# EAGLE design MN_RFID (EAGLE 9.3.1)
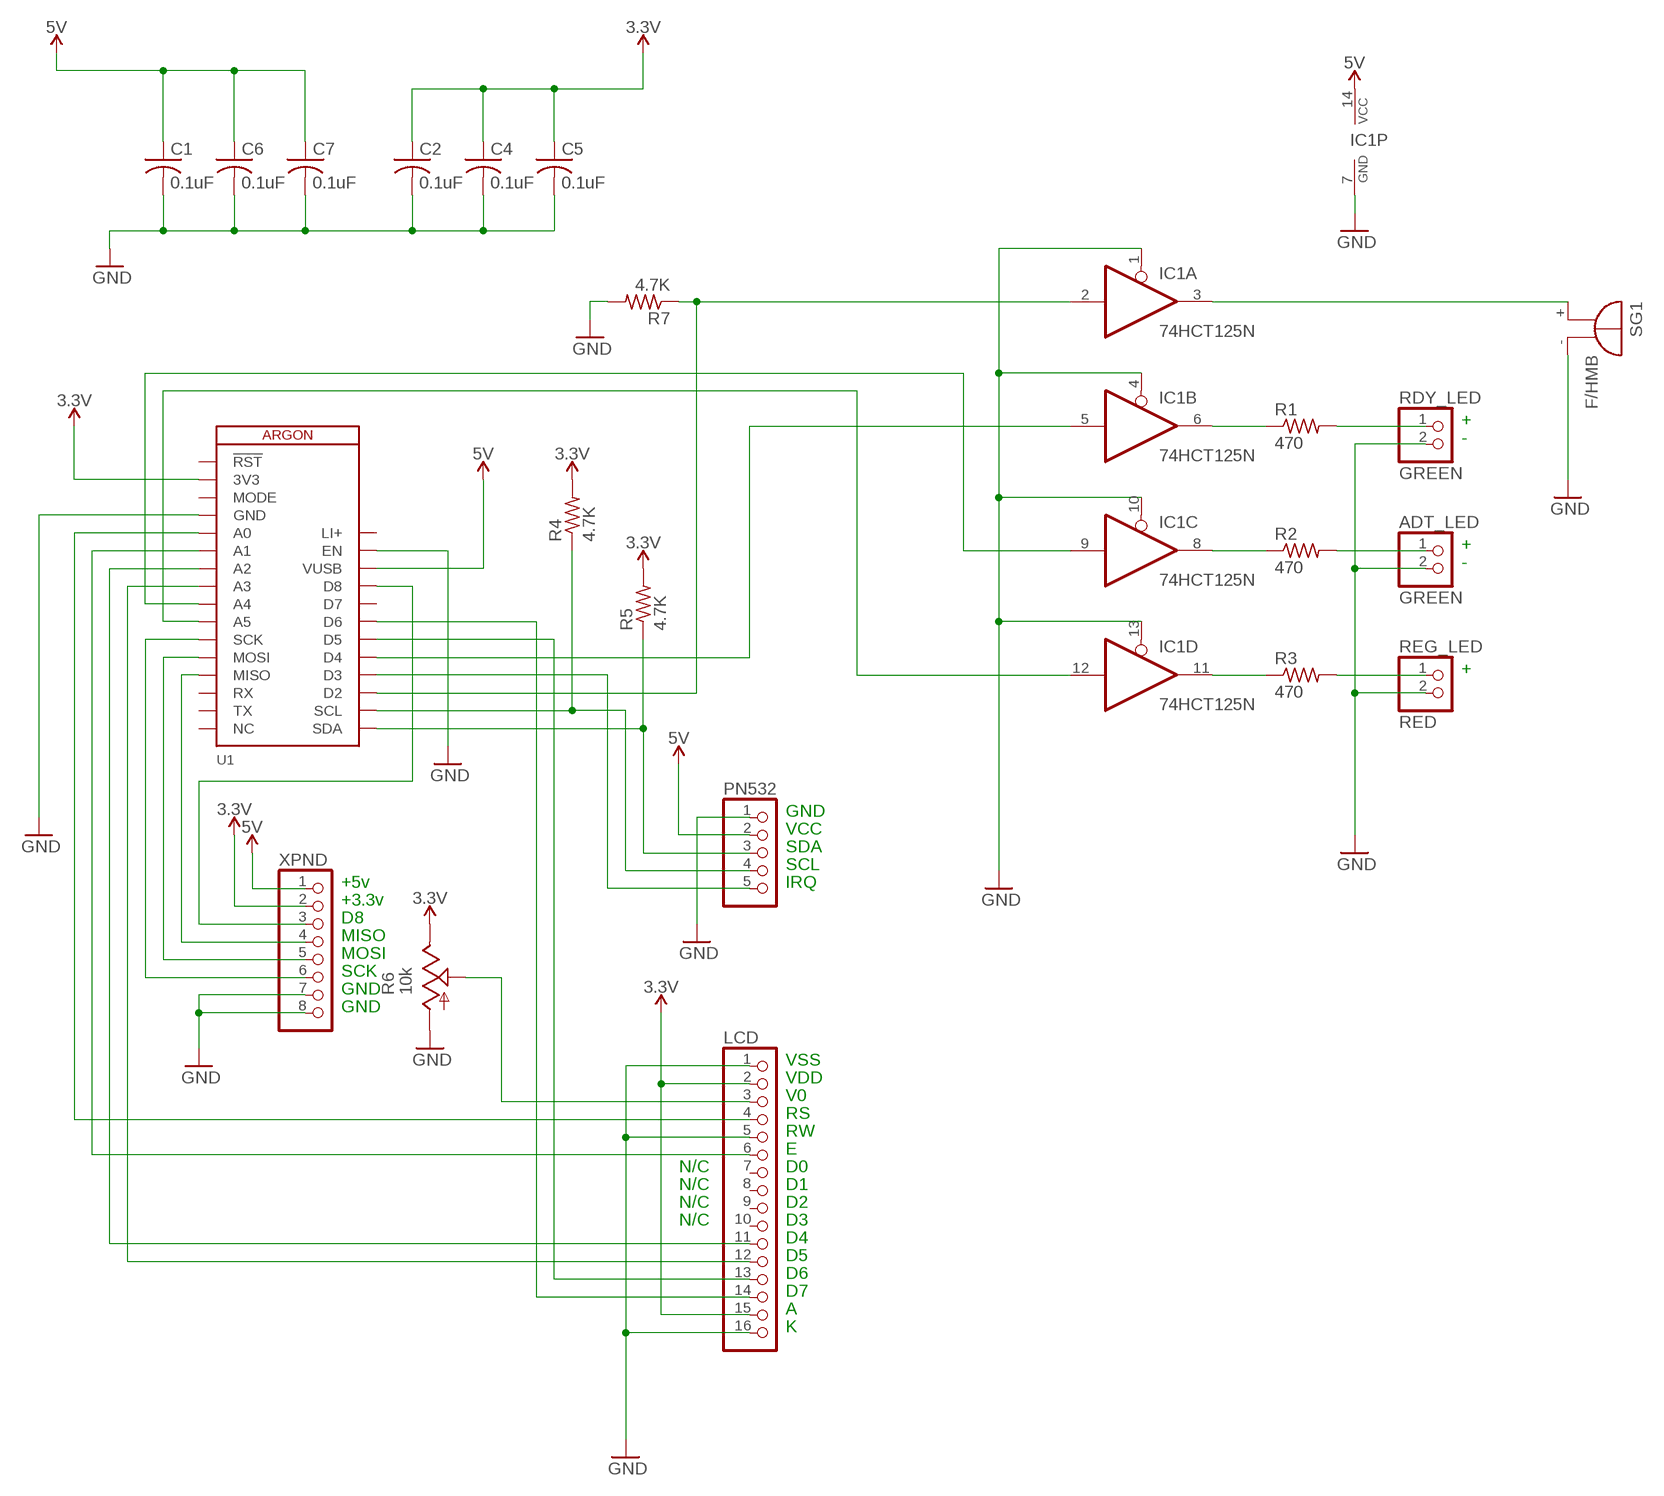
[diagram p0: schematic, sheet 1]

## Parts
ADT_LED  GREEN  PINHD-1X2  [1X02]
C1  0.1uF  C-US025-024X044  [C025-024X044]
C2  0.1uF  C-US025-024X044  [C025-024X044]
C4  0.1uF  C-US025-024X044  [C025-024X044]
C5  0.1uF  C-US025-024X044  [C025-024X044]
C6  0.1uF  C-US025-024X044  [C025-024X044]
C7  0.1uF  C-US025-024X044  [C025-024X044]
IC1  74HCT125N  [DIL14]
LCD  PINHD-1X16  [1X16]
PN532  PINHD-1X5  [1X05]
R1  470  R-US_0204/7  [0204/7]
R2  470  R-US_0204/7  [0204/7]
R3  470  R-US_0204/7  [0204/7]
R4  4.7K  R-US_0204/7  [0204/7]
R5  4.7K  R-US_0204/7  [0204/7]
R6  10k  TRIM_US-CT6  [CT6]
R7  4.7K  R-US_0204/7  [0204/7]
RDY_LED  GREEN  PINHD-1X2  [1X02]
REG_LED  RED  PINHD-1X2  [1X02]
SG1  F/HMB  [F/HMB]
U1  ARGON  [ARGON]
XPND  PINHD-1X8BIG  [1X08-BIG]

## Nets
3.3V: C2.1 C4.1 C5.1 LCD.2 LCD.15 R4.2 R5.2 R6.E U1.2(3V3) XPND.2
5V: C1.1 C6.1 C7.1 IC1.14(P:VCC) PN532.2 U1.26(VUSB) XPND.1
GND: ADT_LED.2 C1.2 C2.2 C4.2 C5.2 C6.2 C7.2 IC1.1(A:OE) IC1.4(B:OE) IC1.7(P:GND) IC1.10(C:OE) IC1.13(D:OE) LCD.1 LCD.5 LCD.16 PN532.1 R6.A R7.2 RDY_LED.2 REG_LED.2 SG1.- U1.4(GND) U1.27(EN) XPND.7 XPND.8
N$1: IC1.3(A:O) SG1.+
N$2: IC1.6(B:O) R1.1
N$3: IC1.8(C:O) R2.1
N$4: IC1.11(D:O) R3.1
N$5: R1.2 RDY_LED.1
N$6: ADT_LED.1 R2.2
N$7: R3.2 REG_LED.1
N$8: LCD.4 U1.5(A0)
N$9: LCD.6 U1.6(A1)
N$10: LCD.11 U1.7(A2)
N$11: LCD.12 U1.8(A3)
N$12: LCD.13 U1.22(D5)
N$13: LCD.14 U1.23(D6)
N$14: PN532.4 R4.1 U1.18(SCL)
N$15: IC1.9(C:I) U1.9(A4)
N$16: PN532.3 R5.1 U1.17(SDA)
N$17: LCD.3 R6.S
N$18: PN532.5 U1.20(D3)
N$19: U1.25(D8) XPND.3
N$20: IC1.5(B:I) U1.21(D4)
N$21: IC1.12(D:I) U1.10(A5)
N$22: IC1.2(A:I) R7.1 U1.19(D2)
N$23: U1.13(MISO) XPND.4
N$24: U1.12(MOSI) XPND.5
N$25: U1.11(SCK) XPND.6
Unconnected: LCD.7 LCD.8 LCD.9 LCD.10 U1.1(!RST) U1.3(MODE) U1.14(RX) U1.15(TX) U1.16(NC) U1.24(D7)

## Notes on the sheet
- +
- -
- +
- -
- +
- GND
- VCC
- SDA
- SCL
- +5v | IRQ
- +3.3v
- D8
- MISO
- MOSI
- SCK
- GND
- GND
- VSS
- VDD
- V0
- RS
- RW
- E
- N/C | D0
- N/C | D1
- N/C | D2
- N/C | D3
- D4
- D5
- D6
- D7
- A
- K

## Power pins joined to a net without a drawn wire
LI+: U1.28(LI+)

## Library data of the parts
ADT_LED RDY_LED REG_LED = pinhead:PINHD-1X2: PIN HEADER
C1 C2 C4-C7 = adafruit:C-US: CAPACITOR, American symbol
IC1 = 74xx-eu:74*125: Quad bus BUFFER, 3-state
LCD = pinhead:PINHD-1X16: PIN HEADER
PN532 = pinhead:PINHD-1X5: PIN HEADER
R1-R5 R7 = adafruit:R-US_: RESISTOR, American symbol
R6 = pot:TRIM_US-: POTENTIOMETER
SG1 = buzzer:F/HMB: BUZZER Source: Buerklin; OC_FARNELL: unknown; OC_NEWARK: unknown
U1 = Particle-Devices:ARGON: ARGON The Particle Argon is a powerful Wi-Fi development kit that you can use as a standalone Wi-Fi device or Wi-Fi enabled gateway, repeater, or endpoint for Particle Mesh networks. More information: https://docs.particle.io/argon/ Footprint and formfactor based on Adafruit Feather. <https://www.adafruit.com/feather>
XPND = adafruit:PINHD-1X8: PIN HEADER

## Board
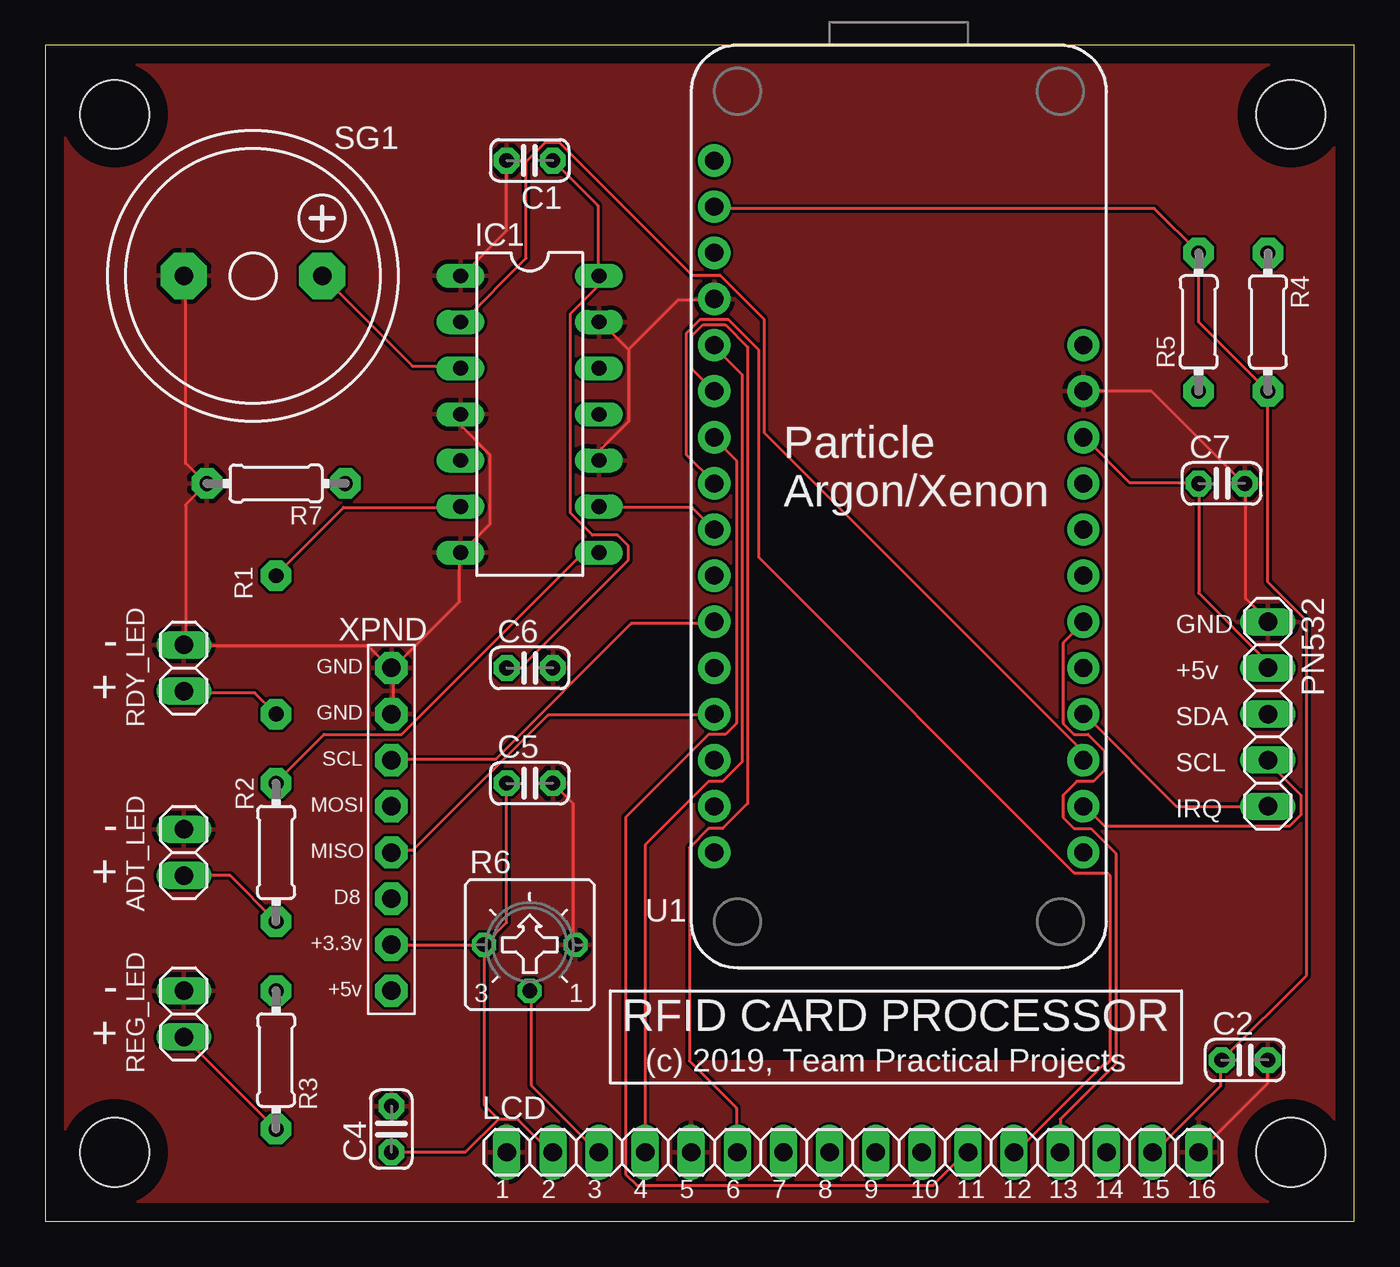
[diagram p1: board, top side]
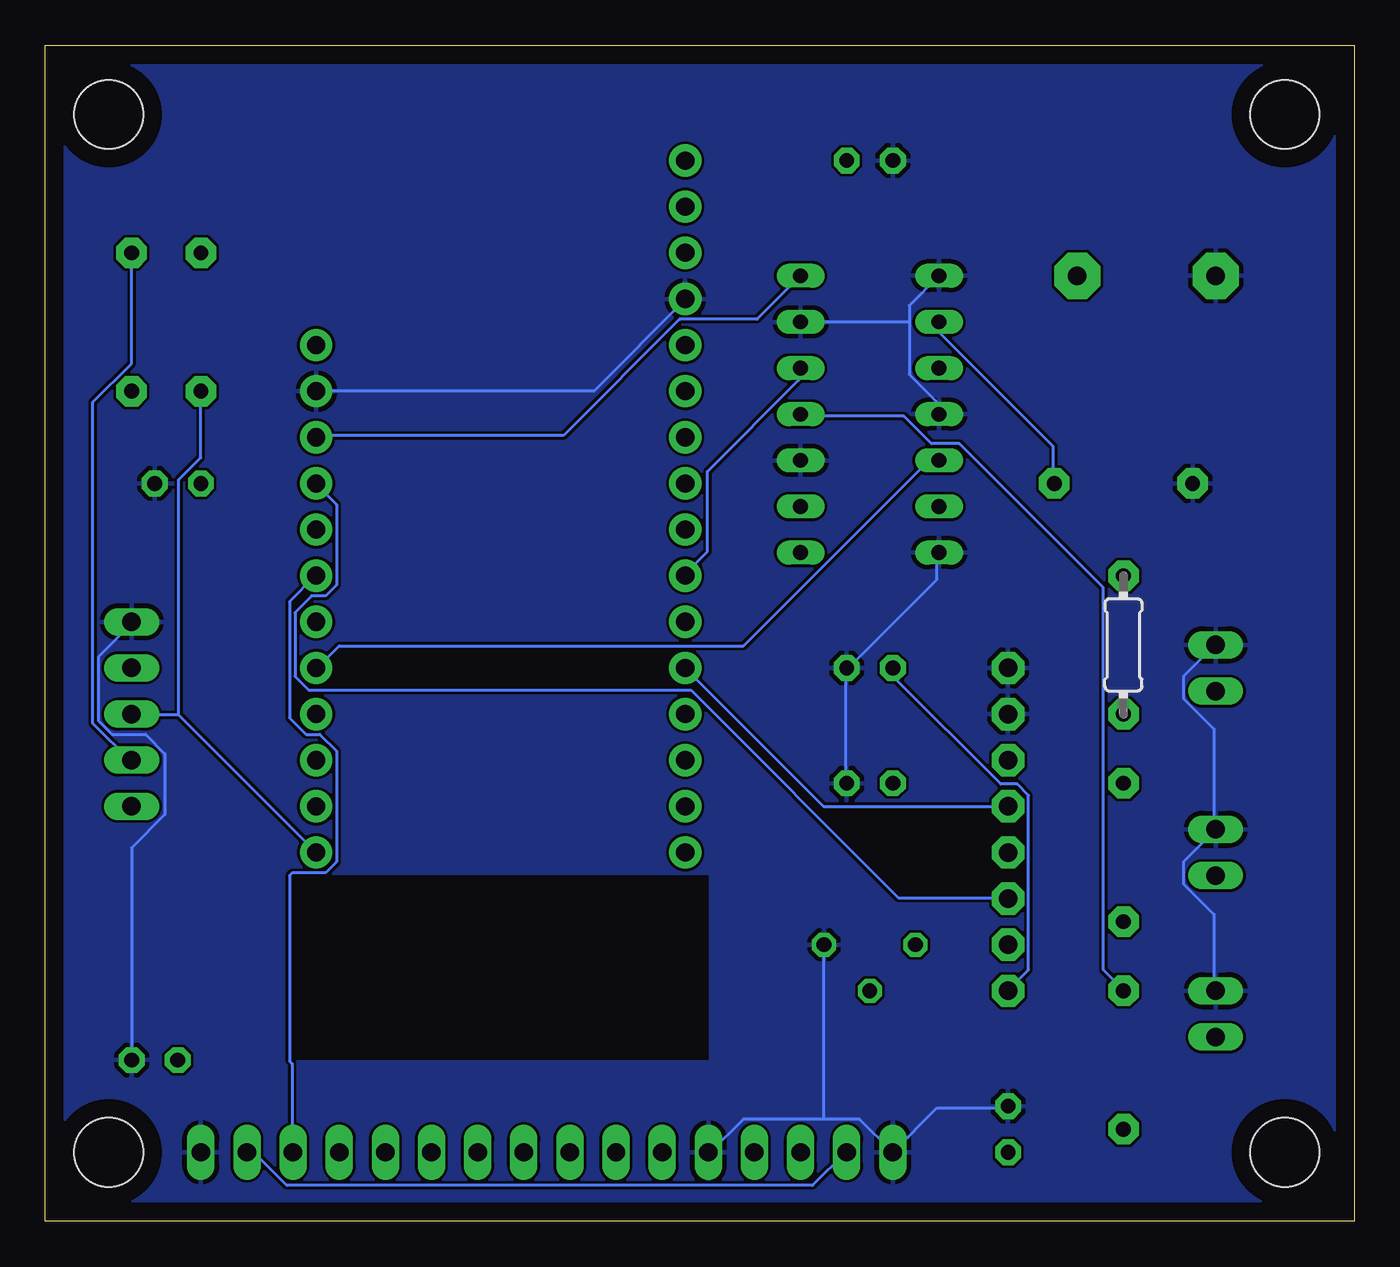
[diagram p2: board, bottom side, seen from below]

Size 72.06 x 64.76 mm. Coordinates in mm from the lower left corner, seen from the top.
Outline: 0,0 72.06,0 72.06,64.76 0,64.76 0,0
Copper layers (1*16): Top 0.035mm / dielectric 1.5mm / Bottom 0.035mm
Design rules "default": minimum track width 6mil, minimum drill 0.35mm, track to track 6mil, track to pad 6mil, pad to pad 6mil, via to via 6mil, smd to smd 6mil, copper to edge 40mil, drill to drill 6mil, minimum pad ring 10mil, minimum via ring 8mil, stop-mask expansion 4mil, vias tented up to drill 0mil, thermal gap 10mil
Holes 3.8 mm at 3.81,60.96 68.58,60.96 3.81,3.81 68.58,3.81

### Footprints (pad centres in the part's own frame; a part is rotated, then mirrored left to right if it is on the bottom)
1X02 = drill 1.016 long: 1 -1.27,0; 2 1.27,0
C025-024X044 = drill 0.813 pad 1.422 octagon: 1 -1.27,0; 2 1.27,0
DIL14 = drill 0.813 long: 1 -7.62,-3.81; 2 -5.08,-3.81; 3 -2.54,-3.81; 4 0,-3.81; 5 2.54,-3.81; 6 5.08,-3.81; 7 7.62,-3.81; 8 7.62,3.81; 9 5.08,3.81; 10 2.54,3.81; 11 0,3.81; 12 -2.54,3.81; 13 -5.08,3.81; 14 -7.62,3.81
1X16 = drill 1.016 long: 1 -19.05,0; 2 -16.51,0; 3 -13.97,0; 4 -11.43,0; 5 -8.89,0; 6 -6.35,0; 7 -3.81,0; 8 -1.27,0; 9 1.27,0; 10 3.81,0; 11 6.35,0; 12 8.89,0; 13 11.43,0; 14 13.97,0; 15 16.51,0; 16 19.05,0
1X05 = drill 1.016 long: 1 -5.08,0; 2 -2.54,0; 3 0,0; 4 2.54,0; 5 5.08,0
0204/7 = drill 0.813 pad 1.676 octagon: 1 -3.81,0; 2 3.81,0
CT6 = drill 0.813 octagon: A 2.515,0; E -2.515,0; S 0,-2.54
F/HMB = drill 1.016 pad 2.54 octagon: + 3.81,0; - -3.81,0
ARGON = drill 1 pad 1.778: 1 1.27,44.45; 2 1.27,41.91; 3 1.27,39.37; 4 1.27,36.83; 5 1.27,34.29; 6 1.27,31.75; 7 1.27,29.21; 8 1.27,26.67; 9 1.27,24.13; 10 1.27,21.59; 11 1.27,19.05; 12 1.27,16.51; 13 1.27,13.97; 14 1.27,11.43; 15 1.27,8.89; 16 1.27,6.35; 17 21.59,6.35; 18 21.59,8.89; 19 21.59,11.43; 20 21.59,13.97; 21 21.59,16.51; 22 21.59,19.05; 23 21.59,21.59; 24 21.59,24.13; 25 21.59,26.67; 26 21.59,29.21; 27 21.59,31.75; 28 21.59,34.29
1X08-BIG = drill 1.016 pad 1.778 octagon: 1 -8.89,0; 2 -6.35,0; 3 -3.81,0; 4 -1.27,0; 5 1.27,0; 6 3.81,0; 7 6.35,0; 8 8.89,0

### Placement (x,y rotation side)
ADT_LED  7.62,20.32 90 top
C1  26.67,58.42 180 top
C2  66.04,8.89 0 top
C4  19.05,5.08 90 top
C5  26.67,24.13 0 top
C6  26.67,30.48 0 top
C7  64.77,40.64 0 top
IC1  26.67,44.45 270 top
LCD  44.45,3.81 0 top
PN532  67.31,27.94 270 top
R1  12.7,31.75 270 bottom
R2  12.7,20.32 270 top
R3  12.7,8.89 270 top
R4  67.31,49.53 270 top
R5  63.5,49.53 90 top
R6  26.67,15.24 0 top
R7  12.7,40.64 180 top
RDY_LED  7.62,30.48 90 top
REG_LED  7.62,11.43 90 top
SG1  11.43,52.07 0 top
U1  35.56,13.97 0 top
XPND  19.05,21.59 90 top

### Tracks (layer width: path | path; a pad name or v marks a point on that pad's centre or on a via)
3.3V
  Top 0.152: U1.2 36.83,55.78 61.06,55.78 R5.2 63.5,49.53 R4.2 67.31,35.2 69.44,33.07 69.44,13.56 C2.1 64.72,8.84 64.72,7.47 61.06,3.81 LCD.15 | XPND.2 R6.E 24.18,15.24 | C5.1 25.4,16.46 24.18,15.24 | C4.1 23.11,3.81 24.94,5.64 | 24.94,5.64 26.01,5.64 27.84,3.81 LCD.2 | 24.18,15.24 24.18,6.4 24.94,5.64
  Bottom 0.152: LCD.15 60.6,3.81 58.78,1.98 29.82,1.98 27.99,3.81 LCD.2
5V
  Top 0.152: U1.26 57.25,43.13 59.69,40.69 63.5,40.69 C7.1 63.5,34.59 67.31,30.78 PN532.2 | C1.1 30.43,55.93 30.43,52.12 IC1.14 30.43,51.97 30.43,51.51 28.91,49.99 28.91,39.01 30.12,37.79 31.5,37.79 32.11,37.19 32.11,36.42 26.16,30.48 C6.1
  Bottom 0.152: C6.1 25.4,30.02 19.46,24.08 18.54,24.08 17.93,23.47 17.93,13.87 19,12.8 XPND.1 | IC1.14 32.87,49.68 37.13,49.68 43.54,43.28 57.1,43.28 U1.26
GND
  Top 0.152: C2.2 67.31,7.62 LCD.16 | PN532.1 67.31,33.07 66.09,34.29 66.09,40.54 C7.2 65.94,40.69 60.91,45.72 U1.27 | SG1.- 7.72,51.97 7.72,41.76 8.79,40.69 R7.2 7.72,39.47 7.72,31.85 RDY_LED.2 7.72,31.7 17.78,31.7 19,30.48 XPND.8 19.15,30.48 | 32.11,48.01 32.11,44.04 30.58,42.52 30.58,41.91 IC1.10 | 32.11,48.01 30.58,49.53 IC1.13 | 32.11,48.01 34.85,50.75 36.83,50.75 U1.4 | C1.2 25.4,54.56 22.96,52.12 IC1.1 | 19.15,30.48 22.81,34.14 22.81,36.73 IC1.7 22.96,36.88 24.49,38.41 24.49,42.21 22.96,43.74 22.96,44.35 IC1.4 | 19.15,30.48 19.15,28.04 XPND.7 | C5.2 29.06,23.01 29.06,15.24 R6.A
  Bottom 0.152: C2.2 67.31,20.57 65.48,22.4 65.48,25.76 66.55,26.82 68.38,26.82 69.14,27.58 69.14,31.09 67.31,32.92 PN532.1 | REG_LED.2 7.72,12.8 7.72,16.92 9.4,18.59 9.4,19.81 ADT_LED.2 7.72,21.64 7.72,27.13 9.4,28.8 9.4,30.02 7.72,31.7 RDY_LED.2 | 24.49,49.53 24.49,50.44 IC1.1 | 24.49,49.53 24.49,46.63 22.96,45.11 22.96,44.5 IC1.4 | 24.49,49.53 IC1.13 | C4.2 19.15,6.25 22.96,6.25 LCD.1 27.23,5.64 29.21,5.64 | 29.21,5.64 33.63,5.64 35.46,3.81 LCD.5 | C5.2 27.99,24.23 27.99,30.48 C6.2 27.84,30.48 22.96,35.36 22.96,36.73 IC1.7 | 29.21,5.64 29.21,15.24 R6.A | U1.27 41.86,45.72 36.83,50.75 U1.4
  pour Top: 0,0 0,64.77 72.39,64.77 72.39,0
  pour Bottom: 0,0 0,64.77 72.39,64.77 72.39,0
N$1
  Top 0.152: SG1.+ 20.22,47.09 22.81,47.09 IC1.3
N$2
  Top 0.152: IC1.6 22.81,39.32 16.41,39.32 12.75,35.66 R1.1
N$3
  Top 0.152: IC1.8 30.43,36.73 29.52,36.73 19.61,26.82 15.34,26.82 12.75,24.23 R2.1
N$4
  Bottom 0.152: IC1.11 30.43,44.35 24.79,44.35 23.27,42.82 21.74,42.82 13.82,34.9 13.82,13.87 12.75,12.8 R3.1
N$5
  Top 0.152: R1.2 11.53,29.11 7.72,29.11 RDY_LED.1
N$6
  Top 0.152: ADT_LED.1 10.16,19.05 R2.2
N$7
  Top 0.152: R3.2 REG_LED.1
N$8
  Top 0.152: LCD.4 33.02,20.73 36.52,24.23 37.29,24.23 38.35,25.3 38.35,46.63 36.83,48.16 U1.5
N$9
  Top 0.152: U1.6 35.61,46.94 35.61,48.77 36.22,49.38 37.44,49.38 38.66,48.16 38.66,23.01 37.29,21.64 36.52,21.64 35.46,20.57 35.46,8.84 38.05,6.25 38.05,3.81 LCD.6
N$10
  Top 0.152: LCD.11 50.7,3.81 48.87,1.98 32.56,1.98 31.95,2.59 31.95,22.25 36.52,26.82 37.44,26.82 38.05,27.43 38.05,41.91 36.83,43.13 U1.7
N$11
  Top 0.152: LCD.12 53.44,3.81 58.32,8.69 58.47,8.69 58.62,8.84 58.62,19.05 58.47,19.2 56.64,19.2 39.27,36.58 39.27,48.01 37.59,49.68 36.07,49.68 35.31,48.92 35.31,42.21 36.83,40.69 U1.8
N$12
  Top 0.152: LCD.13 55.88,5.64 58.93,8.69 58.93,20.27 57.56,21.64 56.64,21.64 56.03,22.25 56.03,23.47 56.79,24.23 57.71,24.23 58.32,24.84 58.32,25.91 57.4,26.82 56.64,26.82 56.03,27.43 56.03,31.85 57.1,32.92 U1.22
N$13
  Bottom 0.152: LCD.14 58.47,3.81 58.47,8.69 58.62,8.84 58.62,19.05 58.47,19.2 56.64,19.2 56.03,19.81 56.03,25.91 56.95,26.82 57.71,26.82 58.62,27.74 58.62,34.14 57.25,35.51 U1.23
N$14
  Top 0.152: PN532.4 67.31,25.3 69.14,23.47 69.14,22.4 68.53,21.79 58.32,21.79 57.25,22.86 U1.18
  Bottom 0.152: R4.1 67.31,47.24 69.44,45.11 69.44,27.43 67.31,25.3 PN532.4
N$15
  Top 0.152: U1.9 35.61,39.32 30.58,39.32 IC1.9
N$16
  Bottom 0.152: 64.72,27.89 67.31,27.89 PN532.3 | U1.17 64.72,27.89 | R5.1 63.5,42.06 64.72,40.84 64.72,27.89
N$17
  Top 0.152: R6.S 26.77,12.65 26.77,7.47 30.43,3.81 LCD.3
N$18
  Top 0.152: PN532.5 62.28,22.86 57.25,27.89 U1.20
N$19
  Bottom 0.152: XPND.3 19.15,17.83 25.09,17.83 36.52,29.26 57.56,29.26 58.32,30.02 58.32,33.53 57.4,34.44 56.64,34.44 56.03,35.05 56.03,39.47 57.1,40.54 U1.25
N$20
  Bottom 0.152: IC1.5 23.42,41.91 33.63,31.7 55.88,31.7 57.1,30.48 U1.21
N$21
  Bottom 0.152: IC1.12 30.58,46.94 30.58,46.33 35.61,41.3 35.61,36.88 36.83,35.66 U1.10
N$22
  Top 0.152: U1.19 57.1,25.45 57.1,25.91 39.57,43.43 39.57,49.68 37.13,52.12 35.61,52.12 28.3,59.44 27.53,59.44 26.47,58.37 26.47,53.04 22.96,49.53 IC1.2
  Bottom 0.152: IC1.2 22.81,49.53 22.81,48.92 16.56,42.67 16.56,40.69 R7.1
N$23
  Top 0.152: XPND.4 19.15,20.42 20.22,20.42 27.69,27.89 36.83,27.89 U1.13
N$24
  Bottom 0.152: XPND.5 29.21,22.86 U1.12
N$25
  Top 0.152: XPND.6 19.15,25.45 24.79,25.45 32.26,32.92 36.83,32.92 U1.11

### Text on the board
tPlace: Particle / Argon/Xenon | GND | - | GND | +5v | + | GND | SDA | SCL | SCL | MOSI | IRQ | - | MISO | + | D8 | +3.3v | +5v | - | RFID CARD PROCESSOR | + | (c) 2019, Team Practical Projects | 1 | 2 | 3 | 4 | 5 | 6 | 7 | 8 | 9 | 10 | 11 | 12 | 13 | 14 | 15 | 16